# Altium schematic sheet OPV_Psu.SchDoc
size A4; Organization: HTL Hollabrunn; Address1: Abteilung Elektronik; Address2: Anton Ehrenfried-Straße 10; Address3: 2020 Hollabrunn; SPICEModelCacheKALKJBRQ: <root> / <DocumentId>KALKJBRQ</DocumentId> / <CacheFrame Number="0"> / <Model Name="cap" Kind="MDL"> / <Text>*Default semiconductor capacitor / .MODEL CAP C()</Text> / </Model> / </CacheFrame> / </root>
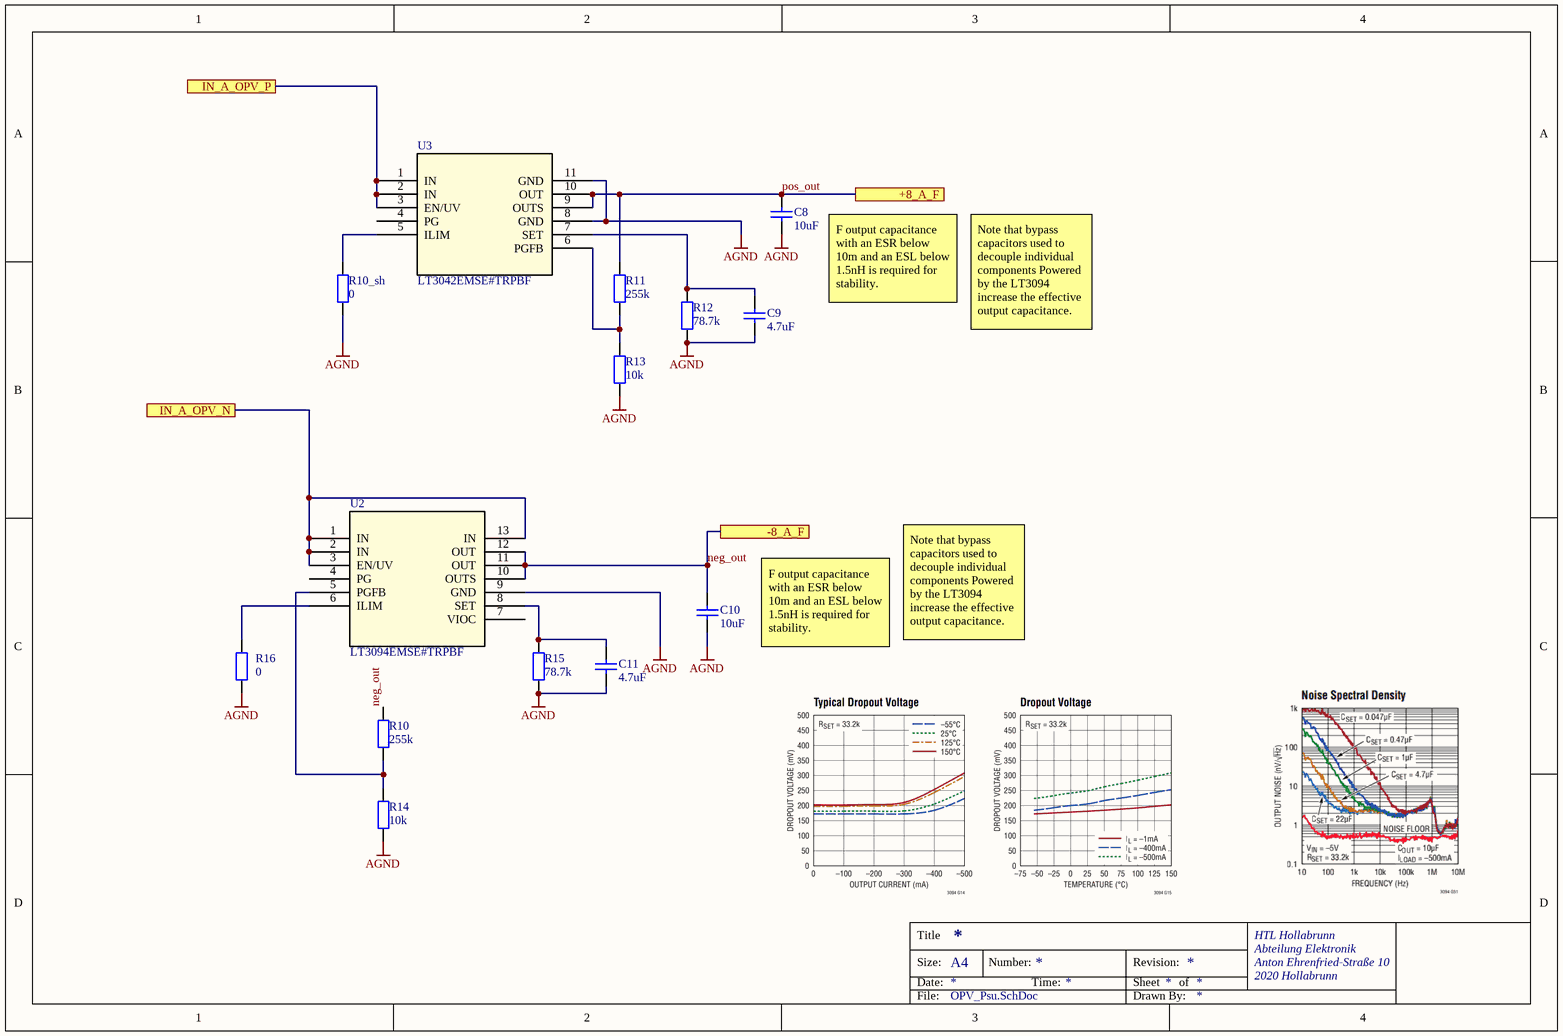
[diagram p0: OPV_Psu.SchDoc]

## Parts
C8  10uF  [C1206-KUE]
C9  4.7uF  [C1206-KUE]
C10  10uF  [C1206-KUE]
C11  4.7uF  [C1206-KUE]
R10  255k  [C1206-KUE]
R10_sh  0  [C1206-KUE]
R11  255k  [C1206-KUE]
R12  78.7k  [C1206-KUE]
R13  10k  [C1206-KUE]
R14  10k  [C1206-KUE]
R15  78.7k  [C1206-KUE]
R16  0  [C1206-KUE]
U2  LT3094EMSE#TRPBF  [MSE_05-08-1666_ADI]
U3  LT3042EMSE#TRPBF  [05-08-1664_ADI]

## Ports
+8_A_F, -8_A_F, IN_A_OPV_N, IN_A_OPV_P

## Nets
AGND: C8.1 C9.1 C10.1 C11.1 R10_sh.2 R12.2 R13.2 R14.2 R15.2 R16.2 U2.9(GND) U3.8(GND) U3.11(GND)
IN_A_OPV_N: U2.1(IN) U2.2(IN) U2.3(EN/UV) U2.13(IN) ; port IN_A_OPV_N
IN_A_OPV_P: U3.1(IN) U3.2(IN) U3.3(EN/UV) ; port IN_A_OPV_P
neg_out: C10.2 R10.1 U2.10(OUTS) U2.11(OUT) U2.12(OUT) ; port -8_A_F
pos_out: C8.2 R11.1 U3.9(OUTS) U3.10(OUT) ; port +8_A_F
NetC9_2: C9.2 R12.1 U3.7(SET)
NetC11_2: C11.2 R15.1 U2.8(SET)
NetR10_2: R10.2 R14.1 U2.5(PGFB)
NetR10_sh_1: R10_sh.1 U3.5(ILIM)
NetR11_2: R11.2 R13.1 U3.6(PGFB)
NetR16_1: R16.1 U2.6(ILIM)

Not connected (* = marked no-connect by the designer): U2 4(PG) 7(VIOC); U3 4(PG)

## Notes on the sheet
- F output capacitance with an ESR below 10m and an ESL below 1.5nH is required for stability.
- Note that bypass capacitors used to decouple individual components Powered by the LT3094 increase the effective output capacitance.
- Title
- Size:
- Date:
- A4
- Number:
- Time:
- Revision:
- Sheet
- of
- HTL Hollabrunn
- Abteilung Elektronik
- Anton Ehrenfried-Straße 10
- 2020 Hollabrunn
- File:
- Drawn By:

## Library data of the parts
C8-C11 = Capacitor: Manufacturer: Kemet; Bezeichnung: Kerko +-10% 63V; Published: 8-Jun-2000; LatestRevisionDate: 17-Jul-2002; LatestRevisionNote: Re-released for DXP Platform.; PackageReference: RAD-0.3; Publisher: Altium Limited; PackageDescription: Radial Cap, Thru-Hole; 2 Leads; 0.3 in Pin Spacing; Orderingcode: *
  C8 C10: Value: 10uF
  C9 C11: Value: 4.7uF
R10 R10_sh R11-R16 = ResistorSMD: Resistor SMD; Manufacturer: AVX; Bezeichnung: SMD Wid. 1/8W 2%; Published: 8-Jun-2000; LatestRevisionDate: 17-Jul-2002; LatestRevisionNote: Re-released for DXP Platform.; PackageReference: AXIAL-0.4; Publisher: Altium Limited; PackageDescription: Axial Device, Thru-Hole; 2 Leads; 0.4 in Pin Spacing; Orderingcode: *
  R10 R11: Value: 255k
  R10_sh R16: Value: 0
  R12 R15: Value: 78.7k
  R13 R14: Value: 10k
U2 = LT3094EMSETRPBF: âˆ’20V, 500mA, Ultralow Noise, Ultrahigh PSRR Negative Linear Regulator; Manufacturer_Name: Analog Devices Inc; Copyright: Copyright (C) 2025 Ultra Librarian. All rights reserved.; Manufacturer_Part_Number: LT3094EMSE#TRPBF; RefDes: RefDes; Type: Type
U3 = LT3042EMSETRPBF: 20V, 200mA, Ultralow Noise, Ultrahigh PSRR RF Linear Regulator; Manufacturer_Name: Analog Devices Inc; Type: Power Management; Copyright: Copyright (C) 2025 Ultra Librarian. All rights reserved.; Manufacturer_Part_Number: LT3042EMSE#TRPBF; RefDes: RefDes